# EAGLE design bpod_stepper_1.5.2 (EAGLE 9.6.2)
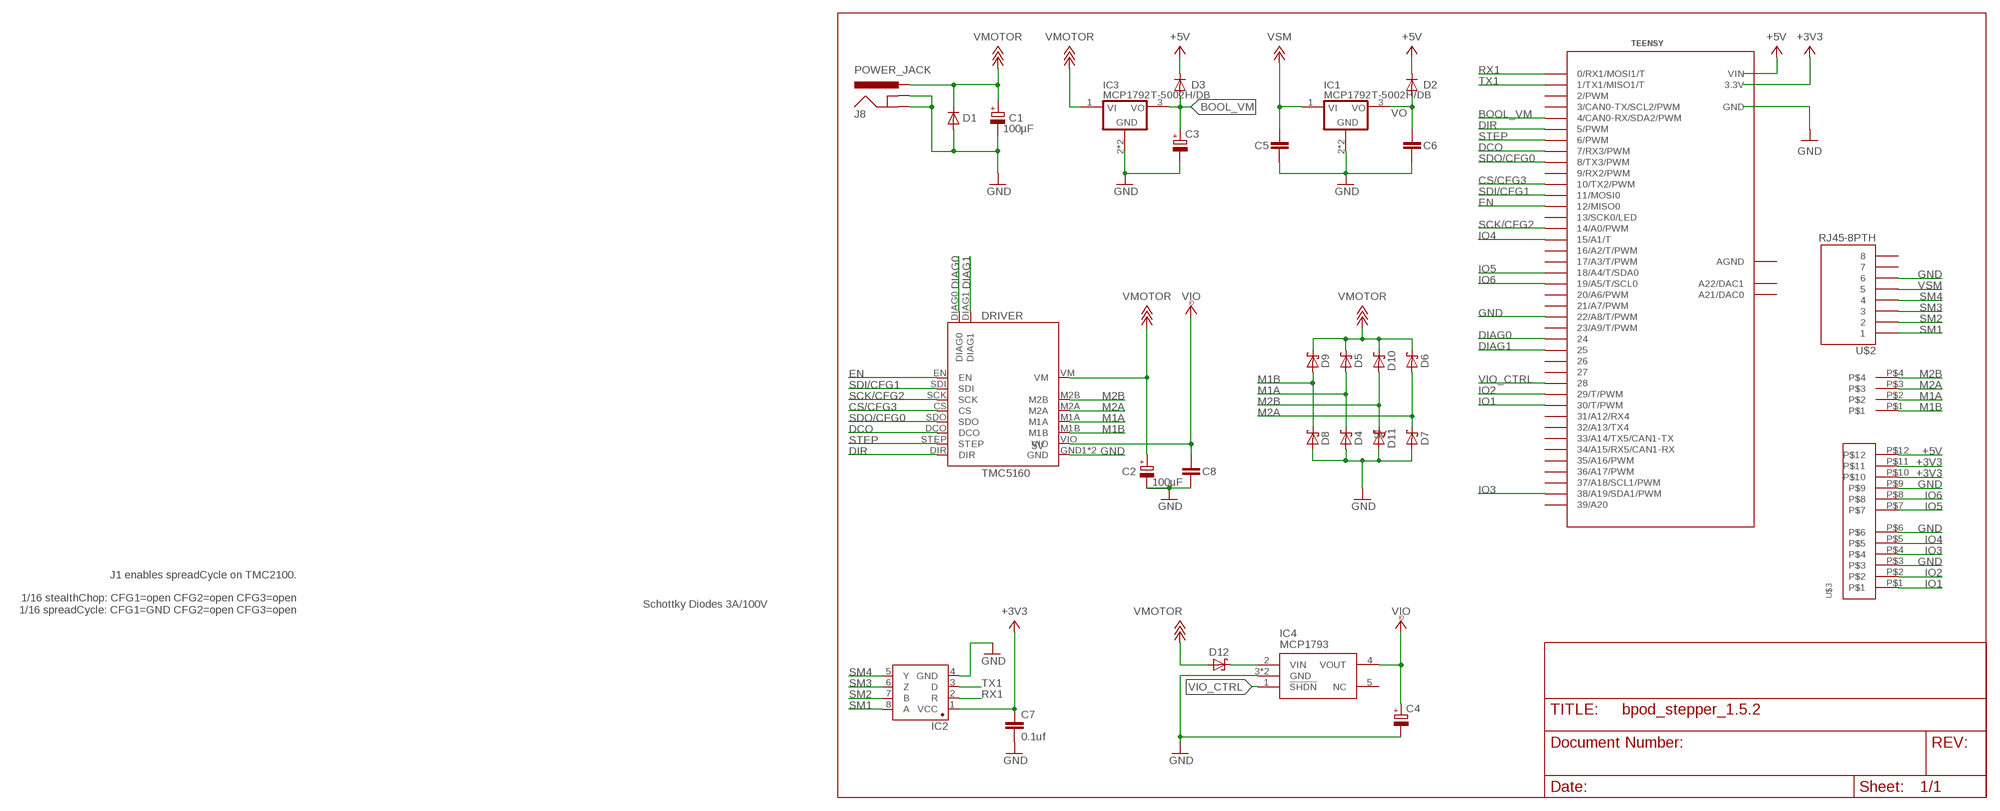
[diagram p0: schematic, sheet 1]

## Parts
C1  100µF  CPOL-EUG  [PANASONIC_G]
C2  100µF  CPOL-EUG  [PANASONIC_G]
C3  CPOL-EUB  [PANASONIC_B]
C4  CPOL-EUB  [PANASONIC_B]
C5  0.1uf  CAP1206  [1206@1]
C6  0.1uf  CAP1206  [1206@1]
C7  0.1uf  CAP1206  [1206@1]
C8  100nf  CAP1206  [1206@1]
D1  DIODE-DO214AA  [DO214AA]
D2  MBR0520LT  [SOD123]
D3  MBR0520LT  [SOD123]
D4  S310FA  D_SCHOTTKY-SOD123  [SOD123]
D5  S310FA  D_SCHOTTKY-SOD123  [SOD123]
D6  S310FA  D_SCHOTTKY-SOD123  [SOD123]
D7  S310FA  D_SCHOTTKY-SOD123  [SOD123]
D8  S310FA  D_SCHOTTKY-SOD123  [SOD123]
D9  S310FA  D_SCHOTTKY-SOD123  [SOD123]
D10  S310FA  D_SCHOTTKY-SOD123  [SOD123]
D11  S310FA  D_SCHOTTKY-SOD123  [SOD123]
D12  S310FA  D_SCHOTTKY-SOD123  [SOD123]
DRIVER  TMC5160  [TMC5160]
IC1  MCP1792T-5002H/DB  [SOT223]
IC2  SN65HVD31DR  [SO08]
IC3  MCP1792T-5002H/DB  [SOT223]
IC4  MCP1793  MCP1793_SOT223-5  [SOT223-5]
J8  POWER_JACK  [POWER_JACK_PTH]
TEENSY  TEENSY_3.6_DIL  [TEENSY_3.6_DIL]
U$2  RJ45-8PTH  [RJ45-8]
U$3  12POS_MOLEX_SOCKET  [12POS_MOLEX_SOCKET]
U$4  MOLEX395221004  [MOLEX395221004]

## Nets
+3V3: C7.1 IC2.1(VCC) TEENSY.3.3V TEENSY.3.3V3(3.3V) U$3.P$10 U$3.P$11
+5V: D2.C D3.C TEENSY.VIN U$3.P$12
BOOL_VM: C3.+ D3.A IC3.3(VO) TEENSY.4(4/CAN0-RX/SDA2/PWM)
CS/CFG3: DRIVER.CS TEENSY.10(10/TX2/PWM)
DCO: DRIVER.DCO TEENSY.7(7/RX3/PWM)
DIAG0: DRIVER.DIAG0 TEENSY.24
DIAG1: DRIVER.DIAG1 TEENSY.25
DIR: DRIVER.DIR TEENSY.5(5/PWM)
EN: DRIVER.EN TEENSY.12(12/MISO0)
GND: C1.- C2.- C3.- C4.- C5.1 C6.1 C7.2 C8.2 D1.A D4.A D7.A D8.A D11.A DRIVER.GND1(GND) DRIVER.GND2(GND) IC1.2(GND) IC1.4(GND) IC2.4(GND) IC3.2(GND) IC3.4(GND) IC4.3(GND) IC4.6(GND) J8.GND J8.GNDBREAK TEENSY.22/A8(22/A8/T/PWM) TEENSY.GND TEENSY.GND1(GND) U$2.6 U$3.P$3 U$3.P$6 U$3.P$9
IO1: TEENSY.30(30/T/PWM) U$3.P$1
IO2: TEENSY.29(29/T/PWM) U$3.P$2
IO3: TEENSY.38/A19(38/A19/SDA1/PWM) U$3.P$4
IO4: TEENSY.15/A1(15/A1/T) U$3.P$5
IO5: TEENSY.18/A4(18/A4/T/SDA0) U$3.P$7
IO6: TEENSY.19/A5(19/A5/T/SCL0) U$3.P$8
M1A: D4.C D5.A DRIVER.M1A U$4.P$2
M1B: D8.C D9.A DRIVER.M1B U$4.P$1
M2A: D6.A D7.C DRIVER.M2A U$4.P$3
M2B: D10.A D11.C DRIVER.M2B U$4.P$4
N$1: D12.C IC4.2(VIN)
RX1: IC2.2(R) TEENSY.0(0/RX1/MOSI1/T)
SCK/CFG2: DRIVER.SCK TEENSY.14/A0(14/A0/PWM)
SDI/CFG1: DRIVER.SDI TEENSY.11(11/MOSI0)
SDO/CFG0: DRIVER.SDO TEENSY.8(8/TX3/PWM)
SM1: IC2.8(A) U$2.1
SM2: IC2.7(B) U$2.2
SM3: IC2.6(Z) U$2.3
SM4: IC2.5(Y) U$2.4
STEP: DRIVER.STEP TEENSY.6(6/PWM)
TX1: IC2.3(D) TEENSY.1(1/TX1/MISO1/T)
VIO: C4.+ C8.1 DRIVER.VIO IC4.4(VOUT) ; supply symbol labelled VCCIO
VIO_CTRL: IC4.1(!SHDN) TEENSY.28
VMOTOR: C1.+ C2.+ D1.C D5.C D6.C D9.C D10.C D12.A DRIVER.VM IC3.1(VI) J8.PWR ; supply symbol labelled +18V
VO: C6.2 D2.A IC1.3(VO)
VSM: C5.2 IC1.1(VI) U$2.5 ; supply symbol labelled +12V
Unconnected: IC4.5(NC) TEENSY.2(2/PWM) TEENSY.3(3/CAN0-TX/SCL2/PWM) TEENSY.9(9/RX2/PWM) TEENSY.13(13/SCK0/LED) TEENSY.16/A2(16/A2/T/PWM) TEENSY.17/A3(17/A3/T/PWM) TEENSY.20/A6(20/A6/PWM) TEENSY.21/A7(21/A7/PWM) TEENSY.23/A9(23/A9/T/PWM) TEENSY.26 TEENSY.27 TEENSY.31/A12(31/A12/RX4) TEENSY.32/A13(32/A13/TX4) TEENSY.33/A14(33/A14/TX5/CAN1-TX) TEENSY.34/A15(34/A15/RX5/CAN1-RX) TEENSY.35/A16(35/A16/PWM) TEENSY.36/A17(36/A17/PWM) TEENSY.37/A18(37/A18/SCL1/PWM) TEENSY.39/A20 TEENSY.A21(A21/DAC0) TEENSY.A22(A22/DAC1) U$2.7 U$2.8

## Notes on the sheet
- 5V
- 5V
- J1 enables spreadCycle on TMC2100.
  
  1/16 stealthChop: CFG1=open CFG2=open CFG3=open
  1/16 spreadCycle: CFG1=GND CFG2=open CFG3=open
- Schottky Diodes 3A/100V

## Power pins joined to a net without a drawn wire
AGND: TEENSY.AGND

## Library data of the parts
C1-C4 = rcl:CPOL-EU: POLARIZED CAPACITOR, European symbol; SPICEPREFIX: C
C5-C8 = SparkFun-Capacitors:CAP: Capacitor Standard 0603 ceramic capacitor, and 0.1" leaded capacitor.
D1 = diode:DIODE-: DIODE
D2 D3 = diode:MBR0520LT: SCHOTTKY BARRIER RECTIFIER Source: http://onsemi.com .. MBR0520LT1-D.pdf
D4-D12 = we-rcl:D_SCHOTTKY: Schottky Diodes 1A, 30V - SOD323 (BAS3010 or CUS10S40) 2A, 30V - SMA/DO214AC 10A,45V - Z5-T (CDBZ5T1045)
DRIVER = TMC5160:TMC5160
IC1 IC3 = MCP1792_3:MCP1792T-5002H/DB
IC2 = Joshparts4:SN65HVD31DR: A placeholder for generic narrow & wide SOIC8 foorptints - used on the DIP adapter board.
IC4 = MCP1793:MCP1793_SOT223-5: MAX1555 Lithium Charger IC SOT-23 Lithium Polymer charging IC. Schematic element and footprint proven. Spark Fun Electronics SKU : COM-00674
J8 = SparkFun-Connectors:POWER_JACK: Power Jack Connector This is the standard 5.5mm barrel jack for power. The PTH is the most common, proven, reliable, footprint. The Slot footprint only works if the mill layer is transmitted to the PCB fab house so be warned. Here are the connectors we sell at SparkFun: DC Barrel Power Jack/Connector <https://www.sparkfun.com/products/119> (PRT-00119) DC Barrel Power Jack/Connector (SMD) <https://www.sparkfun.com/products/12748> (PRT-12748) DC Barrel Jack Adapter - Breadboard Compatible <https://www.sparkfun.com/products/10811> (PRT-10811) It is used on this SparkFun product (and many, many others): SparkFun RedBoard - Programmed with Arduino <https://www.sparkfun.com/products/12757> (DEV-12757) Also, if you need a mating power supply or connector, please check these out: Wall Adapter Power Supply - 9VDC 650mA <https://www.sparkfun.com/products/298> (TOL-00298) DC Barrel Jack Adapter - Male <https://www.sparkfun.com/products/10287> (PRT-10287); PROD_ID: CONN-08197
TEENSY = Teensy_3_and_LC_Series_Boards_v1.4:TEENSY_3.6_DIL: Teensy 3.6 DIL Package
U$2 = SparkFun:RJ45-8: RJ45 Jack Simple RJ45, 8-pin connection - connector for common Cat5, Cat5e, and Cat6 Ethernet cables. Footprint not yet proven in production. Connector sku is PRT-00643; Breakout PCB sku is BOB-00716.
U$3 = JoshParts10:12POS_MOLEX_SOCKET
U$4 = flo:MOLEX395221004

## Board
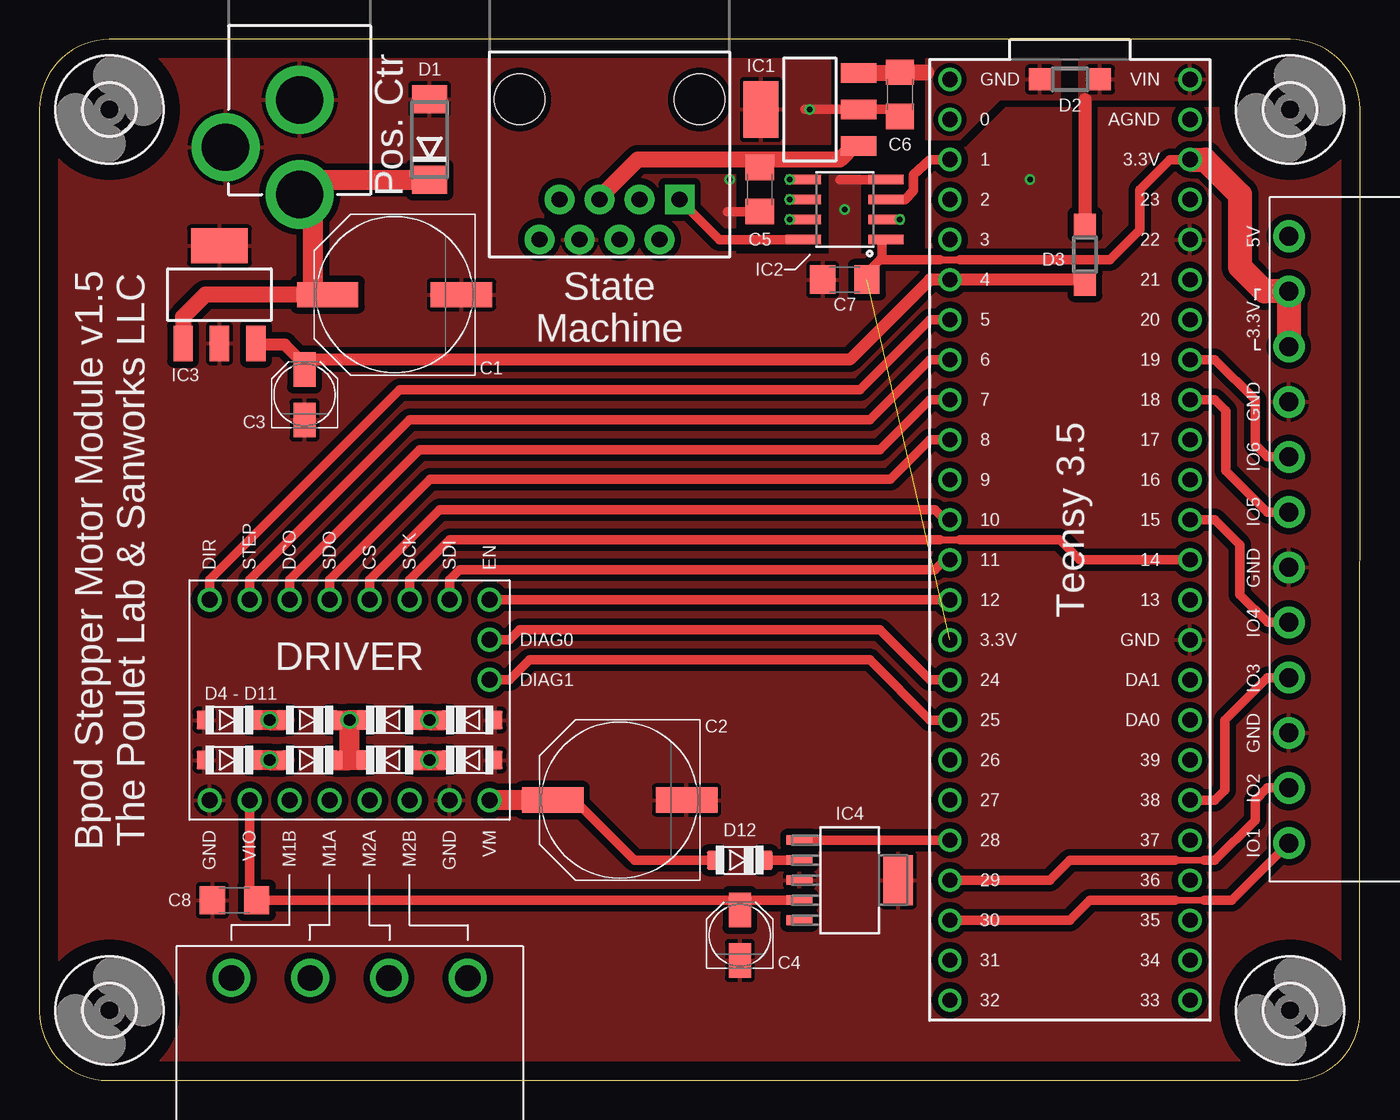
[diagram p1: board, top side]
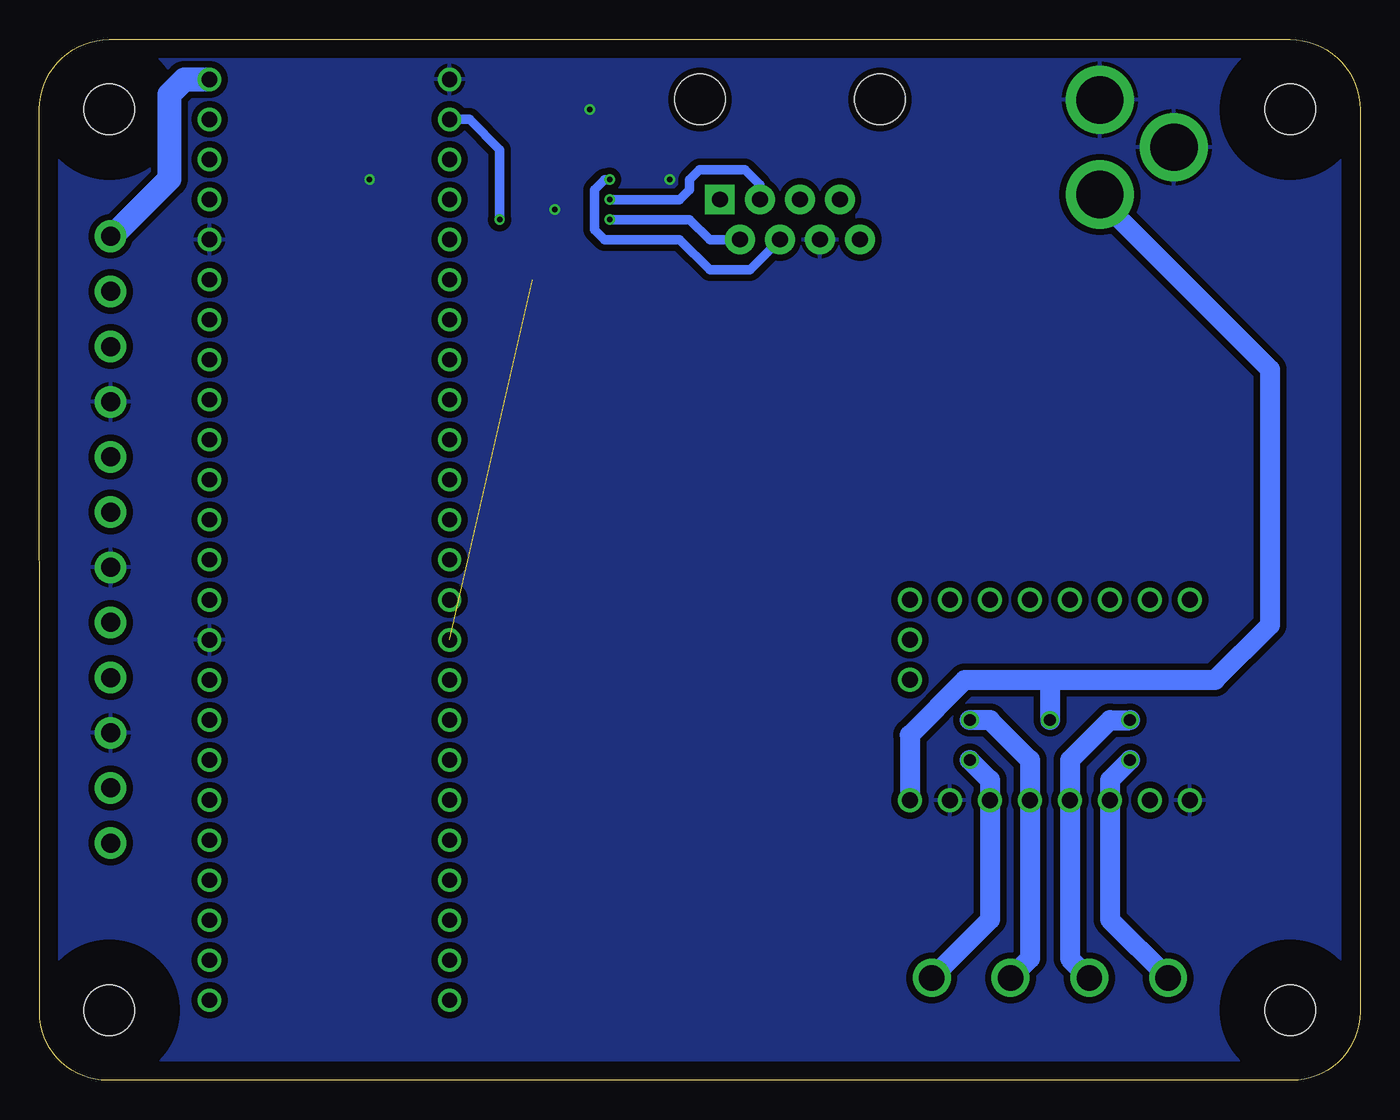
[diagram p2: board, bottom side, seen from below]

Size 83.82 x 66.04 mm. Coordinates in mm from the lower left corner, seen from the top.
Outline: 83.8,4.3 83.82,61.59 arc90 79.38,66.04 4.45,66.04 arc90 0,61.59 0,4.34 arc90 4.34,0 79.5,0 arc90 83.8,4.3
Copper layers (1*16): Top 0.035mm / dielectric 1.5mm / Bottom 0.035mm
Design rules "SeeedStudio_2layer_DRU_no_angle_20140221 *": minimum track width 6mil, minimum drill 12mil, track to track 12mil, track to pad 12mil, pad to pad 12mil, via to via 12mil, smd to smd 0mil, copper to edge 10mil, drill to drill 10mil, minimum pad ring 10mil, minimum via ring 6mil, stop-mask expansion 2mil, vias tented up to drill 100mil, thermal gap 10mil
tRestrict: area 32.8,54.5 to 35.8,54.7
bRestrict: area 32.8,54.5 to 35.8,54.7

### Footprints (pad centres in the part's own frame; a part is rotated, then mirrored left to right if it is on the bottom)
PANASONIC_G = smd 3.9 x 1.6: + 4.25,0; - -4.25,0
PANASONIC_B = smd 2.2 x 1.4: + 1.6,0; - -1.6,0
1206@1 = smd 1.6 x 1.8: 1 -1.4,0; 2 1.4,0
DO214AA = smd 1.8 x 2.2: A 2.55,0; C -2.55,0
SOD123 = smd 1.4 x 1.4: A 1.9,0; C -1.9,0
SOD123' = smd 1.2 x 1: A 0,-1.6; C 0,1.6
TMC5160 = drill 1.016: CS -6.35,1.27; DCO -6.35,-3.81; DIAG0 -3.81,8.89; DIAG1 -1.27,8.89; DIR -6.35,-8.89; EN -6.35,8.89; GND1 6.35,6.35; GND2 6.35,-8.89; M1A 6.35,-1.27; M1B 6.35,-3.81; M2A 6.35,1.27; M2B 6.35,3.81; SCK -6.35,3.81; SDI -6.35,6.35; SDO -6.35,-1.27; STEP -6.35,-6.35; VIO 6.35,-6.35; VM 6.35,8.89
SOT223 = smd 1.219 x 2.235: 1 -2.311,-3.099; 2 0,-3.099; 3 2.311,-3.099 | smd 3.6 x 2.2: 4 0,3.099
SO08 = smd 0.61 x 2.21: 1 -1.905,-2.616; 2 -0.635,-2.616; 3 0.635,-2.616; 4 1.905,-2.616; 5 1.905,2.616; 6 0.635,2.616; 7 -0.635,2.616; 8 -1.905,2.616
SOT223-5 = smd 0.61 x 1.626: 1 -2.54,-3.2; 2 -1.27,-3.2; 3 0,-3.2; 4 1.27,-3.2; 5 2.54,-3.2 | smd 3.175 x 1.854: 6 0,3.073
POWER_JACK_PTH = drill 2.997 pad 4.318: GND 0,7.7; GNDBREAK 4.7,10.7; PWR 0,13.7
TEENSY_3.6_DIL = drill 0.965: 0 -7.62,25.4; 1 -7.62,22.86; 2 -7.62,20.32; 3 -7.62,17.78; 3.3V 7.62,22.86; 3.3V3 -7.62,-7.62; 4 -7.62,15.24; 5 -7.62,12.7; 6 -7.62,10.16; 7 -7.62,7.62; 8 -7.62,5.08; 9 -7.62,2.54; 10 -7.62,0; 11 -7.62,-2.54; 12 -7.62,-5.08; 13 7.62,-5.08; 14/A0 7.62,-2.54; 15/A1 7.62,0; 16/A2 7.62,2.54; 17/A3 7.62,5.08; 18/A4 7.62,7.62; 19/A5 7.62,10.16; 20/A6 7.62,12.7; 21/A7 7.62,15.24; 22/A8 7.62,17.78; 23/A9 7.62,20.32; 24 -7.62,-10.16; 25 -7.62,-12.7; 26 -7.62,-15.24; 27 -7.62,-17.78; 28 -7.62,-20.32; 29 -7.62,-22.86; 30 -7.62,-25.4; 31/A12 -7.62,-27.94; 32/A13 -7.62,-30.48; 33/A14 7.62,-30.48; 34/A15 7.62,-27.94; 35/A16 7.62,-25.4; 36/A17 7.62,-22.86; 37/A18 7.62,-20.32; 38/A19 7.62,-17.78; 39/A20 7.62,-15.24; A21 7.62,-12.7; A22 7.62,-10.16; AGND 7.62,25.4; GND -7.62,27.94; GND1 7.62,-7.62; VIN 7.62,27.94
RJ45-8 = drill 1 pad 1.88 square: 1 -4.445,6.35 | drill 1 pad 1.88: 2 -3.175,8.89; 3 -1.905,6.35; 4 -0.635,8.89; 5 0.635,6.35; 6 1.905,8.89; 7 3.175,6.35; 8 4.445,8.89 | hole 3.2: -5.715,0; 5.715,0
12POS_MOLEX_SOCKET = drill 1.2 pad 2: P$1 -19.239,0.706; P$2 -15.739,0.706; P$3 -12.239,0.706; P$4 -8.739,0.706; P$5 -5.239,0.706; P$6 -1.739,0.706; P$7 1.761,0.706; P$8 5.261,0.706; P$9 8.761,0.706; P$10 12.261,0.706; P$11 15.761,0.706; P$12 19.261,0.706
MOLEX395221004 = drill 1.6: P$1 -7.5,0; P$2 -2.5,0; P$3 2.5,0; P$4 7.5,0
3,2 = hole 3.2: 0,0

### Placement (x,y rotation side)
C1  22.54,49.85 180 top
C2  36.83,17.78 180 top
C3  16.83,43.5 90 top
C4  44.45,9.21 90 top
C5  45.72,56.52 90 top
C6  54.61,62.55 90 top
C7  51.12,50.8 180 top
C8  12.38,11.43 180 top
D1  24.77,59.69 90 top
D2  65.41,63.5 180 top
D3  66.36,52.39 270 top
D4  S310FA  [SOD123']  12.06,22.86 270 top
D5  S310FA  [SOD123']  17.14,22.86 270 top
D6  S310FA  [SOD123']  22.23,22.86 90 top
D7  S310FA  [SOD123']  27.3,22.86 90 top
D8  S310FA  [SOD123']  12.06,20.32 270 top
D9  S310FA  [SOD123']  17.14,20.32 270 top
D10  S310FA  [SOD123']  22.23,20.32 90 top
D11  S310FA  [SOD123']  27.3,20.32 90 top
D12  S310FA  [SOD123']  44.45,13.97 270 top
DRIVER  19.68,24.13 270 top
IC1  48.9,61.59 90 top
IC2  51.12,55.24 90 top
IC3  11.43,49.85 0 top
IC4  51.44,12.7 270 top
J8  16.51,69.9 180 top
TEENSY  65.41,35.56 0 top
U$2  36.19,62.23 180 top
U$3  80,34.29 90 top
U$4  19.68,6.5 0 top
U$7  [3,2]  4.45,4.45 0 top
U$8  [3,2]  4.45,61.59 0 top
U$9  [3,2]  79.38,61.59 0 top
U$10  [3,2]  79.38,4.45 0 top

### Tracks (layer width: path | path; a pad name or v marks a point on that pad's centre or on a via)
+3V3  (1 unrouted)
  Top 0.457: 57.15,52.07 58.42,52.07
  Top 0.61: 58.42,52.07 67.94,52.07 69.85,53.98 69.85,56.52 71.75,58.42 TEENSY.3.3V | C7.1 52.52,51.25 53.34,52.07 53.47,52.07 | IC2.1 53.47,53.34 53.47,52.07 | 53.47,52.07 57.15,52.07
  Top 1.524: TEENSY.3.3V 73.98,58.42 76.2,56.2 76.2,51.6 77.75,50.05 U$3.P$11 U$3.P$10
+5V
  Top 0.813: 66.36,62.23 D3.C
  Bottom 1.524: U$3.P$12 79.21,53.55 75.56,57.19 75.56,62.55 74.61,63.5 TEENSY.VIN
  pour Top (isolate 0.406): 74.3,64.77 74.3,62.23 66.04,62.23 66.04,64.77
BOOL_VM
  Top 0.762: D3.A 66.05,50.8 TEENSY.4 56.52,50.8 51.44,45.72 17.45,45.72 C3.+ | 16.83,45.41 15.57,46.67 13.82,46.67 IC3.3
  Top 0.813: C3.+ 16.83,45.41
CS/CFG3
  Top 0.61: DRIVER.CS 20.95,31.75 25.4,36.2 56.83,36.2 57.47,35.56 TEENSY.10
DCO
  Top 0.61: DRIVER.DCO 15.88,31.75 24.13,40.01 53.34,40.01 56.52,43.18 TEENSY.7
DIAG0
  Top 0.61: TEENSY.24 56.52,25.4 53.34,28.57 30.48,28.57 29.84,27.94 DRIVER.DIAG0
DIAG1
  Top 0.61: DRIVER.DIAG1 29.84,25.4 31.11,26.67 52.7,26.67 56.52,22.86 TEENSY.25
DIR
  Top 0.61: DRIVER.DIR 10.79,31.75 22.86,43.81 52.07,43.81 56.52,48.26 TEENSY.5
EN
  Top 0.61: TEENSY.12 DRIVER.EN
GND  (via drill 0.35)
  Top 0.61: 48.58,61.59 IC1.2 54.16,61.59 C6.1 | C5.1 43.69,55.12 | IC2.4 50.8,57.15
  other vias: 43.81,57.15 51.12,55.24 48.9,61.59 62.87,57.15
  pour Bottom (isolate 0.406): 1.27,64.77 1.27,1.27 82.55,1.27 82.55,64.77
  pour Top (isolate 0.406, rank 2): 1.27,1.27 1.27,64.77 50.16,64.77 50.16,58.42 44.13,58.42 44.13,52.39 50.16,52.39 50.16,57.38 52.07,57.38 52.07,52.39 56.29,52.39 56.29,61.67 74.93,61.67 74.93,64.77 82.55,64.77 82.55,1.27
IO1
  Top 0.406: 72.1,11.43 73.95,11.43
  Top 0.61: U$3.P$1 75.67,11.43 73.95,11.43 | TEENSY.30 65.41,10.16 66.67,11.43 72.1,11.43
IO2
  Top 0.406: 72.1,13.97 73.95,13.97
  Top 0.61: U$3.P$2 77.92,18.55 77.15,17.78 77.15,16.51 74.61,13.97 73.95,13.97 | TEENSY.29 64.14,12.7 65.41,13.97 72.1,13.97
IO3
  Top 0.61: TEENSY.38/A19 74.61,17.78 75.25,18.41 75.25,22.86 77.94,25.55 U$3.P$4
IO4
  Top 0.61: U$3.P$5 77.95,29.05 76.2,30.8 76.2,33.97 74.61,35.56 TEENSY.15/A1
IO5
  Top 0.61: U$3.P$7 77.93,36.05 75.31,38.67 75.31,42.48 74.61,43.18 TEENSY.18/A4
IO6
  Top 0.61: U$3.P$8 77.92,39.55 77.15,40.32 77.15,43.18 74.61,45.72 TEENSY.19/A5
M1A  (via drill 0.75)
  Top 1.27: v14.61,22.86 D5.A D4.C
  Bottom 1.27: U$4.P$2 18.41,7.73 DRIVER.M1A 18.41,20.32 15.88,22.86 v14.61,22.86
M1B  (via drill 0.75)
  Top 1.27: D8.C v14.61,20.32 D9.A
  Bottom 1.27: U$4.P$1 15.88,10.19 DRIVER.M1B 15.88,19.05 v14.61,20.32
M2A  (via drill 0.75)
  Top 1.27: D6.A v24.77,22.86 D7.C
  Bottom 1.27: U$4.P$3 20.95,7.73 DRIVER.M2A 20.95,20.32 23.5,22.86 v24.77,22.86
M2B  (via drill 0.75)
  Top 1.27: D10.A v24.77,20.32 D11.C
  Bottom 1.27: U$4.P$4 23.5,10.19 DRIVER.M2B 23.5,19.05 v24.77,20.32
N$1
  Top 0.61: D12.C IC4.2
RX1  (via drill 0.35)
  Top 0.61: IC2.2 v54.61,54.61
  Bottom 0.61: TEENSY.0 56.52,60.96 54.61,59.05 v54.61,54.61
SCK/CFG2
  Top 0.457: 57.15,34.29 58.42,34.29
  Top 0.61: 57.15,34.29 26.04,34.29 23.5,31.75 DRIVER.SCK | TEENSY.14/A0 66.04,33.02 64.77,34.29 58.42,34.29
SDI/CFG1
  Top 0.61: DRIVER.SDI 26.04,31.75 26.67,32.38 56.83,32.38 57.47,33.02 TEENSY.11
SDO/CFG0
  Top 0.61: DRIVER.SDO 18.41,31.75 24.8,38.14 54.01,38.14 56.52,40.64 TEENSY.8
SM1
  Top 0.61: IC2.8 43.17,53.34 U$2.1
SM2  (via drill 0.35)
  Top 0.61: IC2.7 v47.62,54.61
  Bottom 0.61: v47.62,54.61 42.55,54.61 41.27,53.34 U$2.2
SM3  (via drill 0.35)
  Top 0.61: IC2.6 v47.62,55.88
  Bottom 0.61: v47.62,55.88 43.18,55.88 42.55,56.52 42.55,57.15 41.91,57.78 39.05,57.78 38.09,56.82 U$2.3
SM4  (via drill 0.35)
  Top 0.61: v47.62,57.15 IC2.5
  Bottom 0.61: U$2.4 38.73,51.44 41.27,51.44 43.18,53.34 47.94,53.34 48.58,53.98 48.58,56.52 47.94,57.15 v47.62,57.15
STEP
  Top 0.61: DRIVER.STEP 13.34,31.75 23.5,41.91 52.7,41.91 56.52,45.72 TEENSY.6
TX1
  Top 0.61: TEENSY.1 56.52,58.42 55.47,57.47 55.47,56.43 54.93,55.88 IC2.3
VIO
  Top 0.61: IC4.4 44.45,11.43 | C4.+ 44.45,11.43 | 44.45,11.43 C8.1 13.34,11.43 DRIVER.VIO
VIO_CTRL
  Top 0.61: TEENSY.28 IC4.1
VMOTOR  (via drill 0.75)
  Top 0.61: 31.75,17.78 33.96,17.78 37.77,13.97 D12.A
  Top 1.016: IC3.1 9.12,48.44 10.53,49.85 17.34,49.85
  Top 1.27: 19.68,20.32 v19.68,22.86 | D5.C v19.68,22.86 | D9.C 19.68,20.32 | D10.C 19.68,20.32 | D6.C v19.68,22.86 | DRIVER.VM 31.75,17.78 C2.+ | 17.34,49.85 17.34,54.88 J8.PWR 16.51,57.14 D1.C
  Top 1.524: 17.34,49.85 C1.+
  Bottom 1.27: 19.68,25.4 9.21,25.4 5.71,28.89 5.71,45.09 16.34,55.71 J8.PWR | DRIVER.VM 28.57,21.91 25.08,25.4 19.68,25.4 | 19.68,25.4 v19.68,22.86
VO
  Top 1.016: IC1.3 54.57,63.91 C6.2 56.29,63.95
  pour Top: 64.77,64.77 64.77,62.23 60.96,62.23 58.42,59.69 56.29,59.69 56.29,64.77
VSM
  Top 1.016: U$2.5 35.55,56.01 37.96,58.42 45.72,58.42 | C5.2 45.72,58.42 | 45.72,58.42 50.8,58.42 51.66,59.28 IC1.1

### Text on the board
tPlace: Pos. Ctr | State / Machine
tNames: GND | VIN | 0 | AGND | 1 | 3.3V | 2 | 23 | 5V | 3 | 22 | 4 | 21 | 5 | 20 | 3.3V | 6 | 19 | 7 | 18 | GND | 8 | 17 | IO6 | 9 | 16 | 10 | Teensy 3.5 | 15 | IO5 | Bpod Stepper Motor Module v1.5 / The Poulet Lab & Sanworks LLC | 11 | 14 | GND | 12 | 13 | IO4 | 3.3V | GND | IO3 | 24 | DA1 | D4 - D11 | 25 | DA0 | GND | 26 | 39 | IO2 | 27 | 38 | 28 | 37 | IO1 | 29 | 36 | 30 | 35 | 31 | 34 | 32 | 33